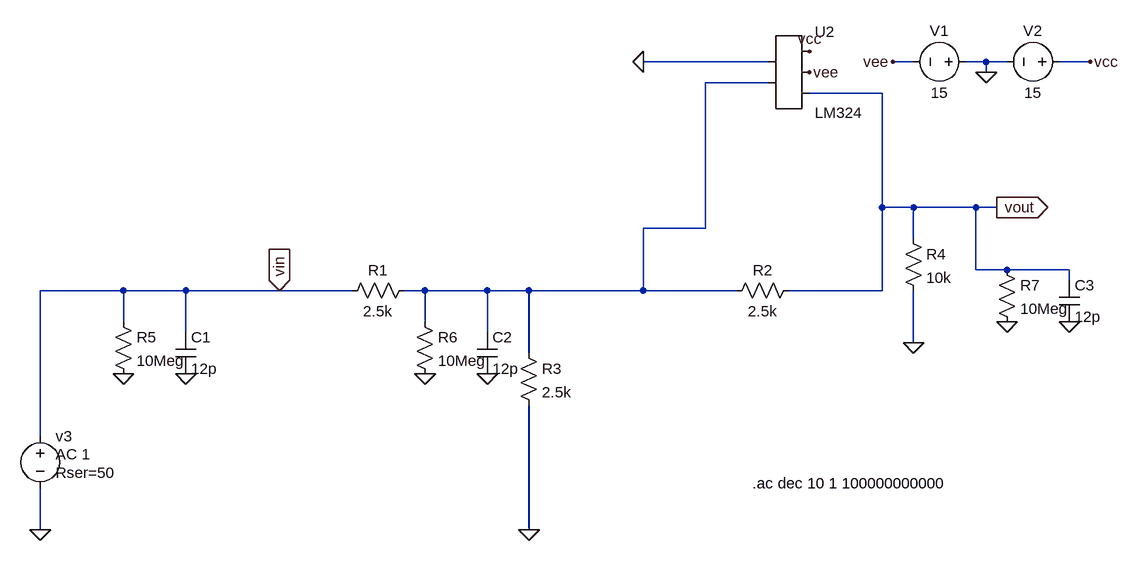
[diagram p0: schematic ej1_circ1_caso2.asc]
ej1_circ1_caso2.asc, the LTspice schematic file:
Version 4
SHEET 1 880 680
WIRE 208 -64 16 -64
WIRE 432 -64 400 -64
WIRE 544 -64 512 -64
WIRE 576 -64 544 -64
WIRE 704 -64 656 -64
WIRE 544 -48 544 -64
WIRE 208 -32 112 -32
WIRE 384 -16 272 -16
WIRE 384 160 384 -16
WIRE 432 160 384 160
WIRE 528 160 432 160
WIRE 560 160 528 160
WIRE 112 192 112 -32
WIRE 112 192 16 192
WIRE 432 208 432 160
WIRE 528 256 528 160
WIRE 576 256 528 256
WIRE 672 256 576 256
WIRE 672 272 672 256
WIRE -784 288 -912 288
WIRE -688 288 -784 288
WIRE -544 288 -688 288
WIRE -432 288 -544 288
WIRE -320 288 -352 288
WIRE -224 288 -320 288
WIRE -160 288 -224 288
WIRE 16 288 16 192
WIRE 16 288 -160 288
WIRE 160 288 16 288
WIRE 384 288 384 160
WIRE 384 288 240 288
WIRE -784 336 -784 288
WIRE -320 336 -320 288
WIRE -688 352 -688 288
WIRE -224 352 -224 288
WIRE 432 368 432 288
WIRE -160 384 -160 288
WIRE -912 512 -912 288
WIRE -912 656 -912 592
WIRE -160 656 -160 464
FLAG 432 368 0
FLAG 560 160 vout
IOPIN 560 160 Out
FLAG 544 -48 0
FLAG 400 -64 vee
FLAG 704 -64 vcc
FLAG -160 656 0
FLAG -544 288 vin
IOPIN -544 288 In
FLAG -912 656 0
FLAG 16 -64 0
FLAG 272 -80 vcc
FLAG 272 -48 vee
FLAG -784 416 0
FLAG -688 416 0
FLAG -320 416 0
FLAG -224 416 0
FLAG 576 336 0
FLAG 672 336 0
SYMBOL res -176 368 R0
SYMATTR InstName R3
SYMATTR Value 2.5k
SYMBOL res 416 192 R0
SYMATTR InstName R4
SYMATTR Value 10k
SYMBOL voltage 528 -64 R90
WINDOW 0 -32 56 VBottom 2
WINDOW 3 32 56 VTop 2
WINDOW 123 0 0 Left 2
WINDOW 39 0 0 Left 2
SYMATTR InstName V1
SYMATTR Value 15
SYMBOL voltage 672 -64 R90
WINDOW 0 -32 56 VBottom 2
WINDOW 3 32 56 VTop 2
WINDOW 123 0 0 Left 2
WINDOW 39 0 0 Left 2
SYMATTR InstName V2
SYMATTR Value 15
SYMBOL voltage -912 496 R0
WINDOW 123 24 44 Left 2
WINDOW 39 24 72 Left 2
SYMATTR Value2 AC 1
SYMATTR SpiceLine Rser=50
SYMATTR InstName v3
SYMATTR Value ""
SYMBOL res -448 304 R270
WINDOW 0 32 56 VTop 2
WINDOW 3 0 56 VBottom 2
SYMATTR InstName R1
SYMATTR Value 2.5k
SYMBOL res 256 272 R90
WINDOW 0 0 56 VBottom 2
WINDOW 3 32 56 VTop 2
SYMATTR InstName R2
SYMATTR Value 2.5k
SYMBOL AutoGenerated\\LM324 240 -48 R0
SYMATTR InstName U2
SYMBOL res -800 320 R0
SYMATTR InstName R5
SYMATTR Value 10Meg
SYMBOL cap -704 352 R0
SYMATTR InstName C1
SYMATTR Value 12p
SYMBOL res -336 320 R0
SYMATTR InstName R6
SYMATTR Value 10Meg
SYMBOL cap -240 352 R0
SYMATTR InstName C2
SYMATTR Value 12p
SYMBOL res 560 240 R0
SYMATTR InstName R7
SYMATTR Value 10Meg
SYMBOL cap 656 272 R0
SYMATTR InstName C3
SYMATTR Value 12p
TEXT 184 584 Left 2 !.ac dec 10 1 100000000000

The netlist it stands for:
* ej1_circ1_caso2.asc
R3 N001 0 2.5k
R4 vout 0 10k
V1 0 vee 15
V2 vcc 0 15
v3 vin 0 AC 1 Rser=50
R1 vin N001 2.5k
R2 vout N001 2.5k
* U2: LM324 (symbol AutoGenerated\LM324 not available, pins judged from their places): pin1=0 pin2=N001 pin3=vcc pin4=vee pin5=vout
R5 vin 0 10Meg
C1 vin 0 12p
R6 N001 0 10Meg
C2 N001 0 12p
R7 vout 0 10Meg
C3 vout 0 12p
.ac dec 10 1 100000000000
.backanno
.end